# Altium schematic sheet CONNECTOR.SchDoc: Connector and OTA
size A4; Author: DODANHLUONG; Revision: 1.0; SheetNumber: 5; SheetTotal: 6; ProjectTitle: DSP_VERSION_1.0
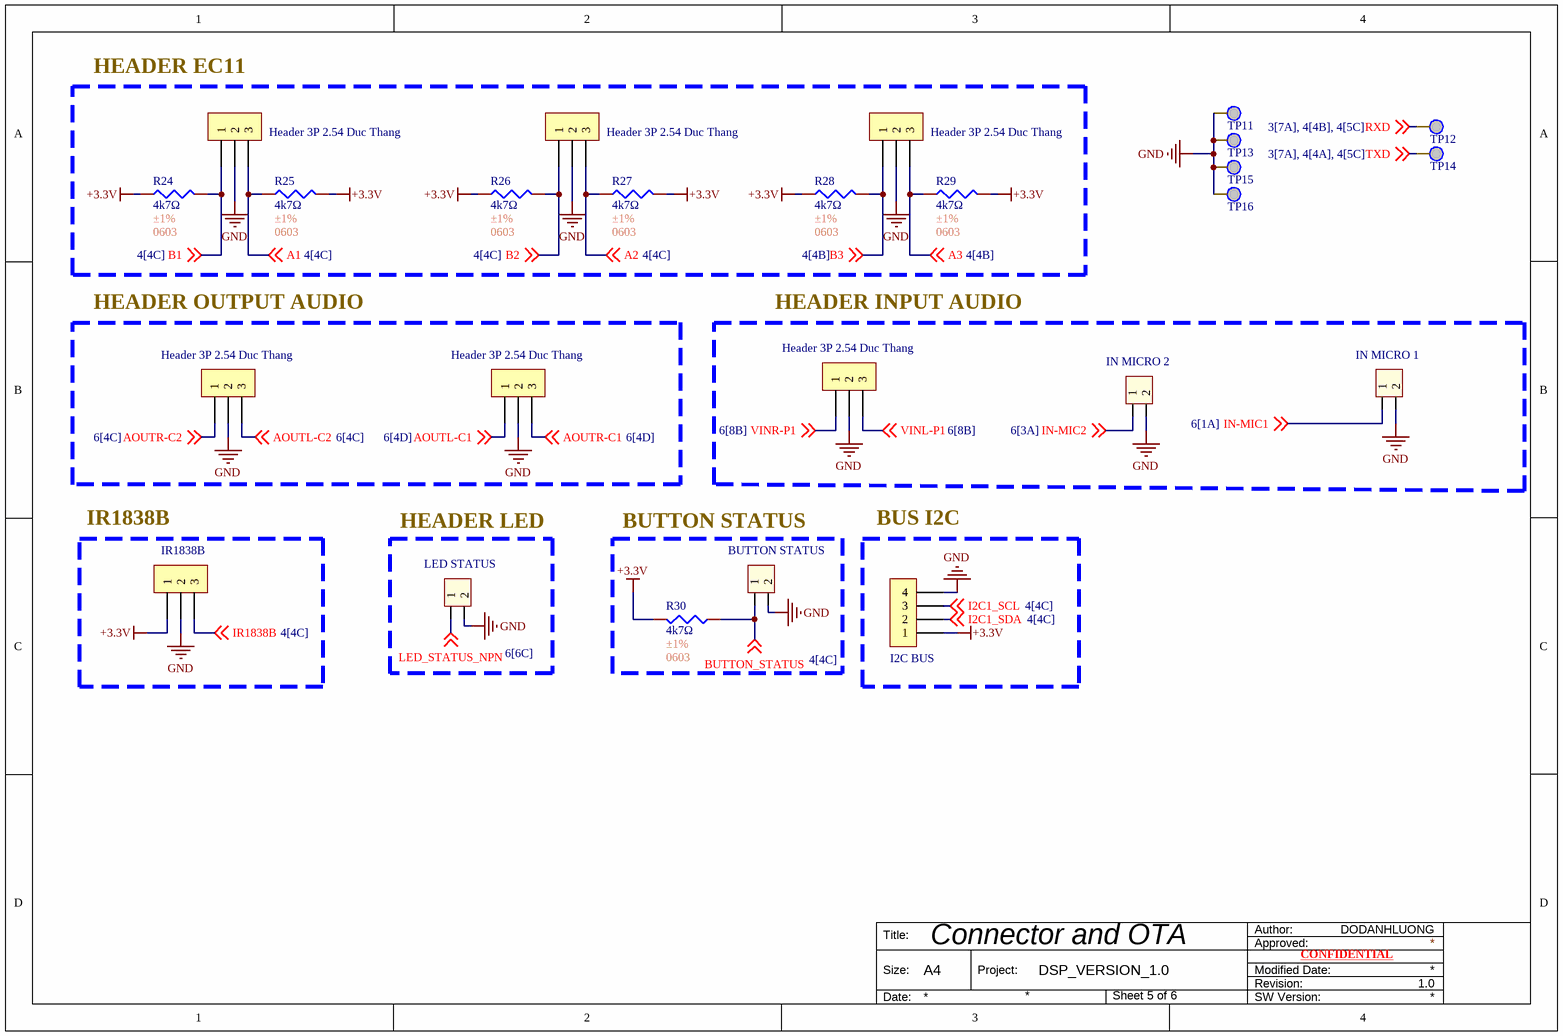
[diagram p0: CONNECTOR.SchDoc]

## Parts
H1  Header 3P 2.54 Duc Thang  [XH2.54M-3]
H2  Header 3P 2.54 Duc Thang  [XH2.54M-3]
H3  Header 3P 2.54 Duc Thang  [XH2.54M-3]
H4  Header 3P 2.54 Duc Thang  [XH2.54M-3]
H5  Header 3P 2.54 Duc Thang  [XH2.54M-3]
H6  Header 3P 2.54 Duc Thang  [XH2.54M-3]
H7  IN MICRO 1  [XH2.54M-2]
H8  IN MICRO 2  [XH2.54M-2]
H9  IR1838B  [XH2.54M-3]
H10  BUTTON STATUS  [XH2.54M-2]
H11  LED STATUS  [XH2.54M-2]
H12  I2C BUS  [XH2.54M-4]
R24  4k7Ω  Tolerance: ±1%  Package: 0603  [R0603]
R25  4k7Ω  Tolerance: ±1%  Package: 0603  [R0603]
R26  4k7Ω  Tolerance: ±1%  Package: 0603  [R0603]
R27  4k7Ω  Tolerance: ±1%  Package: 0603  [R0603]
R28  4k7Ω  Tolerance: ±1%  Package: 0603  [R0603]
R29  4k7Ω  Tolerance: ±1%  Package: 0603  [R0603]
R30  4k7Ω  Tolerance: ±1%  Package: 0603  [R0603]
TP11  TP  [TP]  (value not drawn)
TP12  TP  [TP]  (value not drawn)
TP13  TP  [TP]  (value not drawn)
TP14  TP  [TP]  (value not drawn)
TP15  TP  [TP]  (value not drawn)
TP16  TP  [TP]  (value not drawn)

## Blocks framed on the sheet
HEADER EC11: H1-H3 R24-R29
HEADER OUTPUT AUDIO: H5 H6
HEADER INPUT AUDIO: H4 H7 H8
IR1838B: H9
HEADER LED: H11
BUTTON STATUS: H10 R30
BUS I2C: H12

## Nets
+3.3V: H9.1 H12.1 R24.1 R25.2 R26.1 R27.2 R28.1 R29.2 R30.2
GND: H1.2 H2.2 H3.2 H4.2 H5.2 H6.2 H7.2 H8.2 H9.2 H10.2 H11.2 H12.4 TP11.1 TP13.1 TP15.1 TP16.1
A1: H1.3 R25.1 ; off-sheet A1
A2: H2.3 R27.1 ; off-sheet A2
A3: H3.3 R29.1 ; off-sheet A3
AOUTL-C1: H6.1 ; off-sheet AOUTL-C1
AOUTL-C2: H5.3 ; off-sheet AOUTL-C2
AOUTR-C1: H6.3 ; off-sheet AOUTR-C1
AOUTR-C2: H5.1 ; off-sheet AOUTR-C2
B1: H1.1 R24.2 ; off-sheet B1
B2: H2.1 R26.2 ; off-sheet B2
B3: H3.1 R28.2 ; off-sheet B3
BUTTON_STATUS: H10.1 R30.1 ; off-sheet BUTTON_STATUS
I2C1_SCL: H12.3 ; off-sheet I2C1_SCL
I2C1_SDA: H12.2 ; off-sheet I2C1_SDA
IN-MIC1: H7.1 ; off-sheet IN-MIC1
IN-MIC2: H8.1 ; off-sheet IN-MIC2
IR1838B: H9.3 ; off-sheet IR1838B
LED_STATUS_NPN: H11.1 ; off-sheet LED_STATUS_NPN
RXD: TP12.1 ; off-sheet RXD
TXD: TP14.1 ; off-sheet TXD
VINL-P1: H4.3 ; off-sheet VINL-P1
VINR-P1: H4.1 ; off-sheet VINR-P1

## Notes on the sheet
- Author:
- Title:
- Size:
- A4
- Project:
- Approved:
- Revision:
- Modified Date:
- CONFIDENTIAL
- Date:
- SW Version:

## Library data of the parts
H1-H6 H9 = Header 3P 2.54 Duc Thang: Cắm; Ten_Linh_Kien: Header 3P XH2.54-3P Đực Thẳng; Don_Vi: Con; Ma_Hang: MH001292; Chung_Loai: Cắm
H7 H8 H10 H11 = Header 2P 2.54 Duc Thang: Cắm; Ten_Linh_Kien: Header 2P XH2.54-2P Đực Thẳng; Don_Vi: Con; Ma_Hang: MH001283; Chung_Loai: Cắm
H12 = Header 4P 2.54 Duc Thang: Cắm; Ten_Linh_Kien: Header 4P XH2.54-4P Đực Thẳng; Don_Vi: Con; Ma_Hang: MH001285; Chung_Loai: Cắm
R24-R30 = R0603_4k7Ω_±1%: 62.5mW Thick Film Resistor 50V ±1% ±200ppm/℃ 10Ω 0402 Chip Resistor - Surface Mount ROHS; Manufacturer: YAGEO; Mfr. Part #: RC0402FR-0710RL; LCSC Part #: C138066; Resistance: 4k7Ω; Link: https://www.lcsc.com/product-detail/C138066.html?s_z=n_resistor%25200402%252010R